# EAGLE schematic ArduinoMotorShield (EAGLE 5.02)
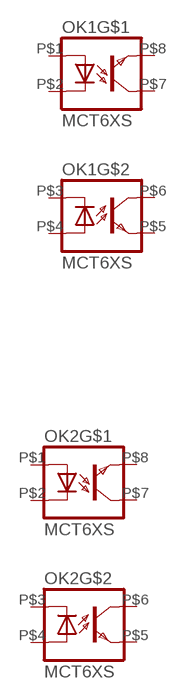
[diagram p0: schematic, sheet 1]

## Parts
OK1  MCT6XS  [SMT]
OK2  MCT6XS  [SMT]
Unconnected: OK1.P$1(A) OK1.P$2(C) OK1.P$3(C) OK1.P$4(A) OK1.P$5(EMIT) OK1.P$6(COL) OK1.P$7(COL) OK1.P$8(EMIT) OK2.P$1(A) OK2.P$2(C) OK2.P$3(C) OK2.P$4(A) OK2.P$5(EMIT) OK2.P$6(COL) OK2.P$7(COL) OK2.P$8(EMIT)

## Library data of the parts
OK1 OK2 = mct6x:MCT6X: SIEMENS OPTO COUPLER